# EAGLE design RefloLeo_v1.3 (EAGLE 6.3)
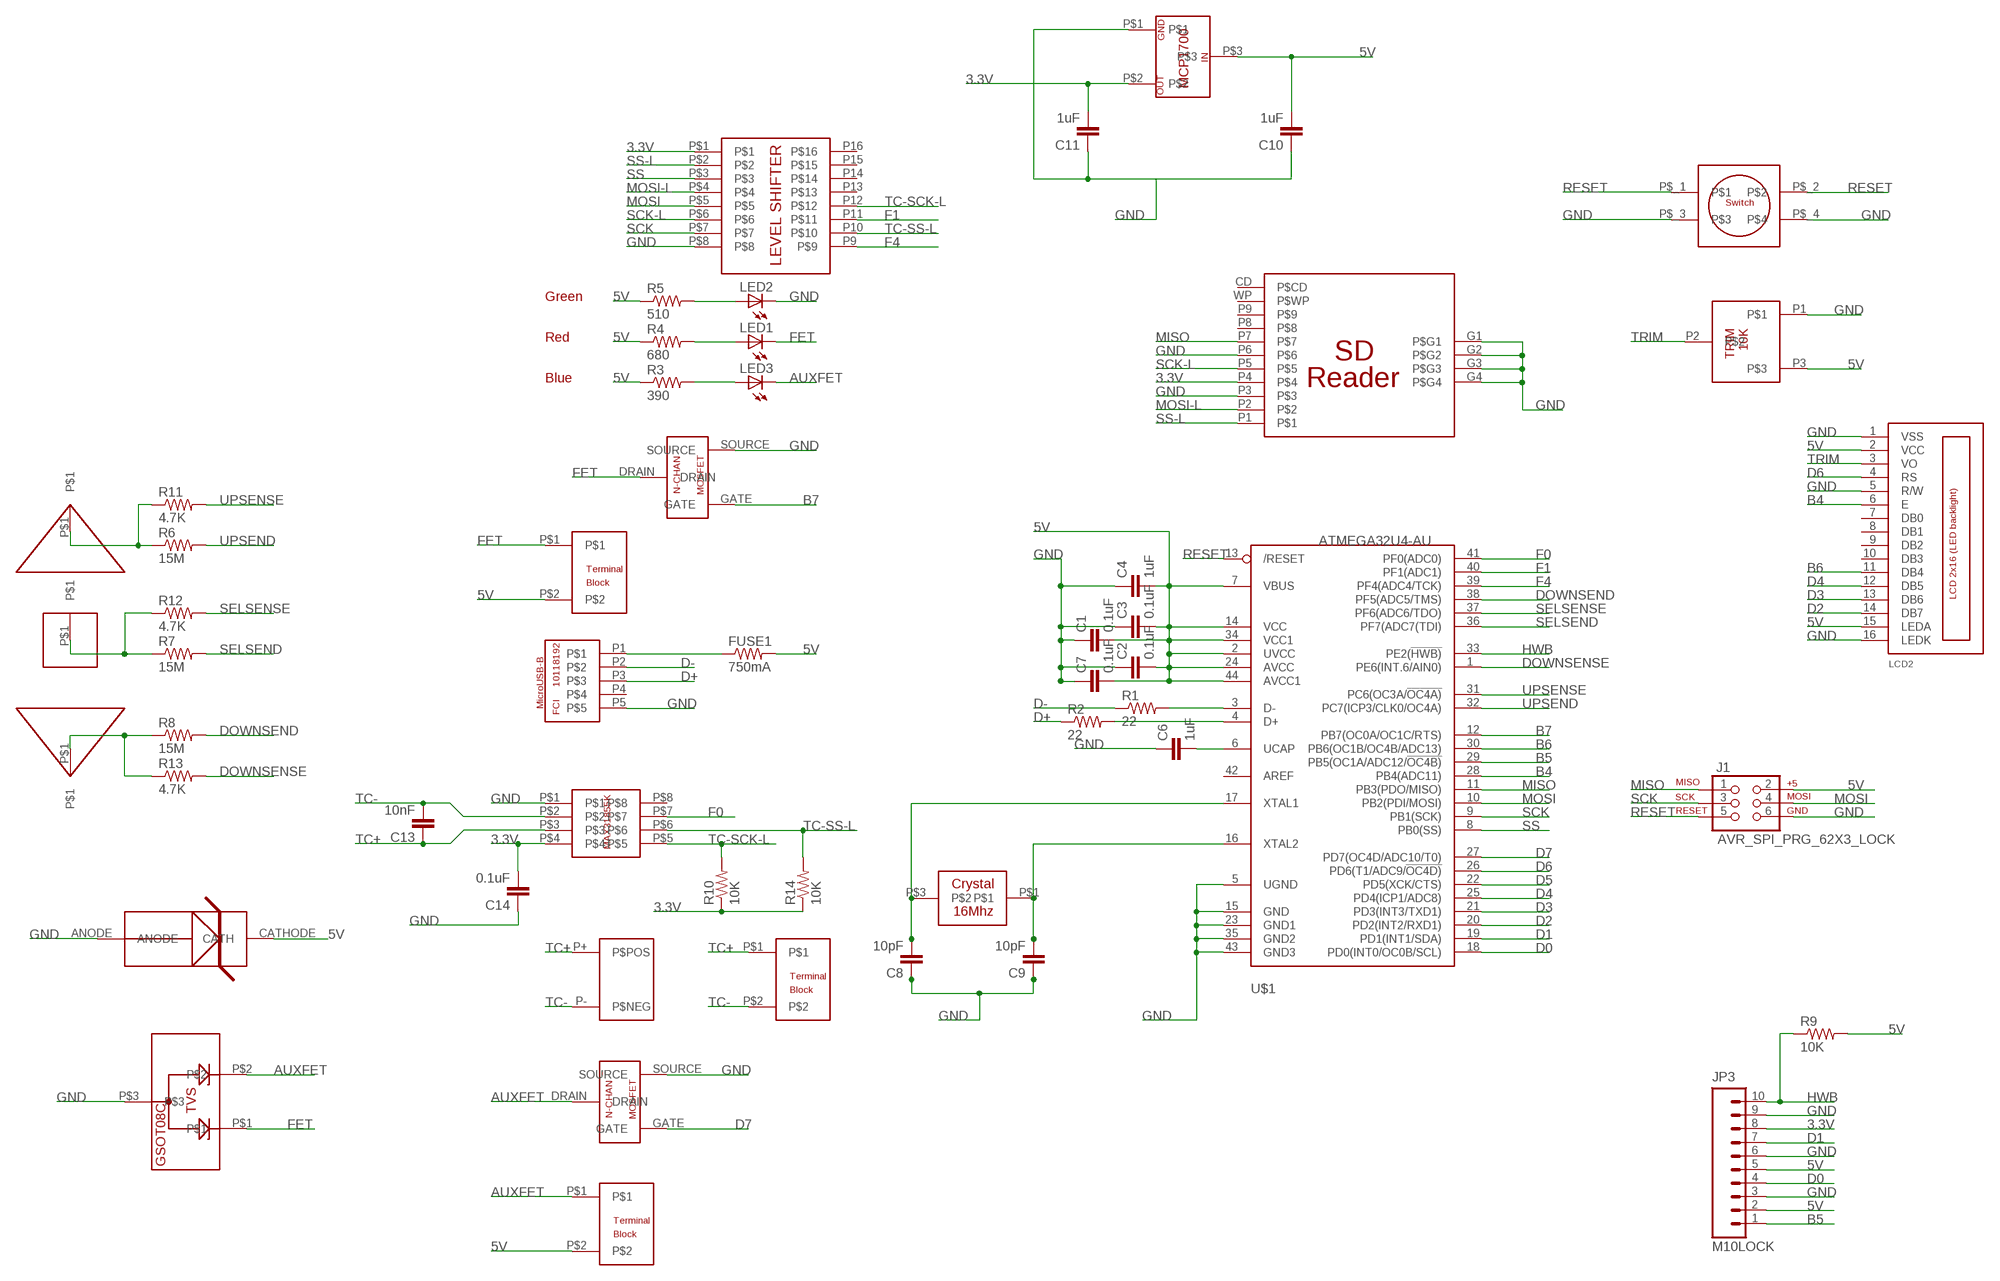
[diagram p0: schematic, sheet 1]

## Parts
C1  0.1uF  CAP0603-CAP  [0603-CAP]
C2  0.1uF  CAP0603-CAP  [0603-CAP]
C3  0.1uF  CAP0603-CAP  [0603-CAP]
C4  1uF  CAP0603-CAP  [0603-CAP]
C6  1uF  CAP0603-CAP  [0603-CAP]
C7  0.1uF  CAP0603-CAP  [0603-CAP]
C8  10pF  CAP0603-CAP  [0603-CAP]
C9  10pF  CAP0603-CAP  [0603-CAP]
C10  1uF  CAP0603-CAP  [0603-CAP]
C11  1uF  CAP0603-CAP  [0603-CAP]
C13  10nF  CAP0603-CAP  [0603-CAP]
C14  0.1uF  CAP0603-CAP  [0603-CAP]
FUSE1  750mA  RESISTOR0603-RES  [0603-RES]
J1  AVR_SPI_PRG_62X3_LOCK  [2X3_LOCK]
JP3  M10LOCK  [1X10_LOCK]
LCD2  LCD_2X16_SIL  [HY-1602F]
LED1  LED0603  [LED-0603]
LED2  LED0603  [LED-0603]
LED3  LED0603  [LED-0603]
R1  22  RESISTOR0603-RES  [0603-RES]
R2  22  RESISTOR0603-RES  [0603-RES]
R3  390  RESISTOR0603-RES  [0603-RES]
R4  680  RESISTOR0603-RES  [0603-RES]
R5  510  RESISTOR0603-RES  [0603-RES]
R6  15M  RESISTOR0603-RES  [0603-RES]
R7  15M  RESISTOR0603-RES  [0603-RES]
R8  15M  RESISTOR0603-RES  [0603-RES]
R9  10K  RESISTOR0603-RES  [0603-RES]
R10  10K  RESISTOR0603-RES  [0603-RES]
R11  4.7K  RESISTOR0603-RES  [0603-RES]
R12  4.7K  RESISTOR0603-RES  [0603-RES]
R13  4.7K  RESISTOR0603-RES  [0603-RES]
R14  10K  RESISTOR0603-RES  [0603-RES]
U$1  ATMEGA32U4-AU  [TQFP44]
U$2  16MHZ-CRYSTAL_NX3225GA-16.000M-STD-CRG-1  [16MHZ-CRYSTAL_NX3225GA-16.000M-STD-CRG-1]
U$3  USB-B_10118192-0001LF  [USB-B_10118192-0001LF]
U$4  SDREADER_2041021-4  [SDREADER_2041021-4]
U$5  2POS_TERM_ED2748-ND  [2POS_TERM_ED2748-ND]
U$6  N-MOSFET630_DMG1012T-7DICT-ND  [N-MOSFET630_DMG1012T-7DICT-ND]
U$7  2POS_TERM_ED2748-ND  [2POS_TERM_ED2748-ND]
U$8  NXP_LVL_SHIFT_74HC4050D,653  [NXP_LVL_SHIFT_74HC4050D,653]
U$9  MAX_TC_MAX31855KASA+  [MAX_TC_MAX31855KASA+]
U$10  10K_TRIM_3362F-1-103LF  [10K_TRIM_3362F-1-103LF]
U$11  MCP1700__LDO  [MCP1700__LDO]
U$12  MOM-SWITCH-EG4620CT-ND  [MOM-SWITCH-EG4620CT-ND]
U$13  CAPTOUCH_ARROW  [CAPTOUCH_ARROW]
U$14  CAPTOUCH_ARROW  [CAPTOUCH_ARROW]
U$15  CAPTOUCH_SQUARE  [CAPTOUCH_SQUARE]
U$16  N-MOSFET630_DMG1012T-7DICT-ND  [N-MOSFET630_DMG1012T-7DICT-ND]
U$17  2POS_TERM_ED2748-ND  [2POS_TERM_ED2748-ND]
U$18  TVS_DIODE_MATRIX_GSOT08C-GS08  [TVS_DIODE_MATRIX_GSOT08C-GS08]
U$19  TVS_DIODE_1CH_1SMB6.0AT3G  [TVS_DIODE_1CH_1SMB6.0AT3G]
U$20  CUSTOM_K-TYPE  [CUSTOM_K-TYPE]

## Nets
3.3V: C11.2 C14.2 JP3.8 R10.1 R14.1 U$4.P4 U$8.P$1 U$9.P$4 U$11.P$2
5V: C1.2 C2.2 C3.2 C4.2 C7.2 C10.2 FUSE1.2 J1.2 JP3.2 JP3.5 LCD2.2(VCC) LCD2.15(LEDA) R3.1 R4.1 R5.1 R9.2 U$1.2(UVCC) U$1.7(VBUS) U$1.14(VCC) U$1.24(AVCC) U$1.34(VCC1) U$1.44(AVCC1) U$5.P$2 U$10.P3 U$11.P$3 U$17.P$2 U$19.CATHODE(CATH)
AUXFET: LED3.C U$16.DRAIN U$17.P$1 U$18.P$2
B4: LCD2.6(E) U$1.28(PB4(ADC11))
B5: JP3.1 U$1.29(PB5(OC1A/ADC12/!OC4B))
B6: LCD2.11(DB4) U$1.30(PB6(OC1B/OC4B/ADC13))
B7: U$1.12(PB7(OC0A/OC1C/RTS)) U$6.GATE
D0: JP3.4 U$1.18(PD0(INT0/OC0B/SCL))
D1: JP3.7 U$1.19(PD1(INT1/SDA))
D2: LCD2.14(DB7) U$1.20(PD2(INT2/RXD1))
D3: LCD2.13(DB6) U$1.21(PD3(INT3/TXD1))
D4: LCD2.12(DB5) U$1.25(PD4(ICP1/ADC8))
D5: U$1.22(PD5(XCK/CTS))
D6: LCD2.4(RS) U$1.26(PD6(T1/ADC9/!OC4D))
D7: U$1.27(PD7(OC4D/ADC10/T0)) U$16.GATE
D+: R2.1 U$3.P3
D-: R1.1 U$3.P2
DOWNSEND: R8.2 U$1.38(PF5(ADC5/TMS))
DOWNSENSE: R13.2 U$1.1(PE6(INT.6/AIN0))
F0: U$1.41(PF0(ADC0)) U$9.P$7
F1: U$1.40(PF1(ADC1)) U$8.P11
F4: U$1.39(PF4(ADC4/TCK)) U$8.P9
FET: LED1.C U$5.P$1 U$6.DRAIN U$18.P$1
GND: C1.1 C2.1 C3.1 C4.1 C6.1 C7.1 C8.1 C9.1 C10.1 C11.1 C14.1 J1.6 JP3.3 JP3.6 JP3.9 LCD2.1(VSS) LCD2.5(R/W) LCD2.16(LEDK) LED2.C U$1.5(UGND) U$1.15(GND) U$1.23(GND1) U$1.35(GND2) U$1.43(GND3) U$3.P5 U$4.G1(P$G1) U$4.G2(P$G2) U$4.G3(P$G3) U$4.G4(P$G4) U$4.P3 U$4.P6 U$6.SOURCE U$8.P$8 U$9.P$1 U$10.P1 U$11.P$1 U$12.P$_3 U$12.P$_4 U$16.SOURCE U$18.P$3 U$19.ANODE
HWB: JP3.10 R9.1 U$1.33(PE2(!HWB))
MISO: J1.1 U$1.11(PB3(PDO/MISO)) U$4.P7
MOSI: J1.4 U$1.10(PB2(PDI/MOSI)) U$8.P$5
MOSI-L: U$4.P2 U$8.P$4
N$1: C8.2 U$1.17(XTAL1) U$2.P$3
N$2: C9.2 U$1.16(XTAL2) U$2.P$1
N$3: LED1.A R4.2
N$4: LED2.A R5.2
N$5: FUSE1.1 U$3.P1
N$6: LED3.A R3.2
N$7: R1.2 U$1.3(D-)
N$8: C6.2 U$1.6(UCAP)
N$9: R2.2 U$1.4(D+)
N$15: R6.1 R11.1 U$13.P$1
N$16: R7.1 R12.1 U$15.P$1
N$17: R8.1 R13.1 U$14.P$1
RESET: J1.5 U$1.13(/RESET) U$12.P$_1 U$12.P$_2
SCK: J1.3 U$1.9(PB1(SCK)) U$8.P$7
SCK-L: U$4.P5 U$8.P$6
SELSEND: R7.2 U$1.36(PF7(ADC7(TDI))
SELSENSE: R12.2 U$1.37(PF6(ADC6/TDO))
SS: U$1.8(PB0(SS)) U$8.P$3
SS-L: U$4.P1 U$8.P$2
TC+: C13.1 U$7.P$1 U$9.P$3 U$20.P+(P$POS)
TC-: C13.2 U$7.P$2 U$9.P$2 U$20.P-(P$NEG)
TC-SCK-L: R10.2 U$8.P12 U$9.P$5
TC-SS-L: R14.2 U$8.P10 U$9.P$6
TRIM: LCD2.3(VO) U$10.P2
UPSEND: R6.2 U$1.32(PC7(ICP3/CLK0/OC4A))
UPSENSE: R11.2 U$1.31(PC6(OC3A/!OC4A))
Unconnected: LCD2.7(DB0) LCD2.8(DB1) LCD2.9(DB2) LCD2.10(DB3) U$1.42(AREF) U$3.P4 U$4.CD(P$CD) U$4.P8 U$4.P9 U$4.WP(P$WP) U$8.P13 U$8.P14 U$8.P15 U$8.P16 U$9.P$8

## Notes on the sheet
- Green
- Red
- Blue

## Library data of the parts
C1-C4 C6-C11 C13 C14 = SparkFun-Capacitors:CAP: Capacitor Standard 0603 ceramic capacitor, and 0.1" leaded capacitor.
FUSE1 R1-R14 = SparkFun-Passives:RESISTOR: Resistor Basic schematic elements and footprints for 0603, 1206, and PTH resistors.
J1 = SparkFun-Connectors:AVR_SPI_PRG_6: AVR ISP 6 Pin This is the reduced ISP connector for AVR programming. Common on Arduino. This footprint will take up less PCB space and can be used with a 10-pin to 6-pin adapter such as SKU: BOB-08508
JP3 = SparkFun-Connectors:M10: Header 10 Standard 10-pin 0.1" header. Use with straight break away headers (SKU : PRT-00116), right angle break away headers (PRT-00553), swiss pins (PRT-00743), machine pins (PRT-00117), and female headers (PRT-00115).
LCD2 = lcd_2x16_led_backlight:LCD_2X16_SIL
LED1-LED3 = SparkFun-LED:LED: LEDs Standard schematic elements and footprints for 5mm, 3mm, 1206, and 0603 sized LEDs. 5mm - Spark Fun Electronics SKU : COM-00529 (and others)
U$1 = adafruit:ATMEGA32U4: http://www.ladyada.net/library/eagle
U$2 = JKCustom:16MHZ-CRYSTAL_NX3225GA-16.000M-STD-CRG-1
U$3 = JKCustom:USB-B_10118192-0001LF
U$4 = JKCustom:SDREADER_2041021-4
U$5 U$7 U$17 = JKCustom:2POS_TERM_ED2748-ND
U$6 U$16 = JKCustom:N-MOSFET630_DMG1012T-7DICT-ND
U$8 = JKCustom:NXP_LVL_SHIFT_74HC4050D,653
U$9 = JKCustom:MAX_TC_MAX31855KASA+
U$10 = JKCustom:10K_TRIM_3362F-1-103LF
U$11 = JKCustom:MCP1700__LDO
U$12 = JKCustom:MOM-SWITCH-EG4620CT-ND
U$13 U$14 = JKCustom:CAPTOUCH_ARROW
U$15 = JKCustom:CAPTOUCH_SQUARE
U$18 = JKCustom:TVS_DIODE_MATRIX_GSOT08C-GS08
U$19 = JKCustom:TVS_DIODE_1CH_1SMB6.0AT3G
U$20 = RefloLeo_Lib:CUSTOM_K-TYPE

## Board
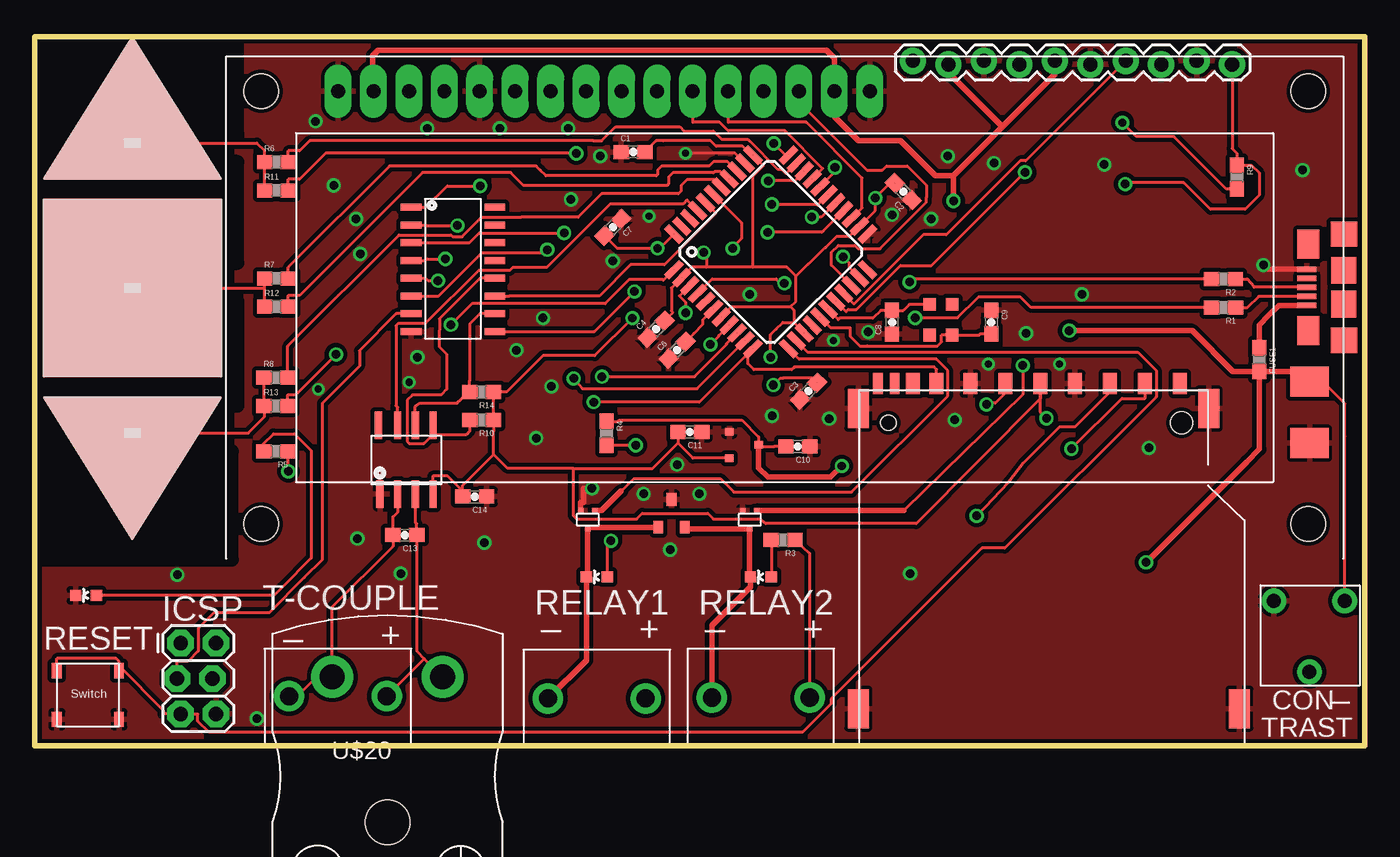
[diagram p1: board, top side]
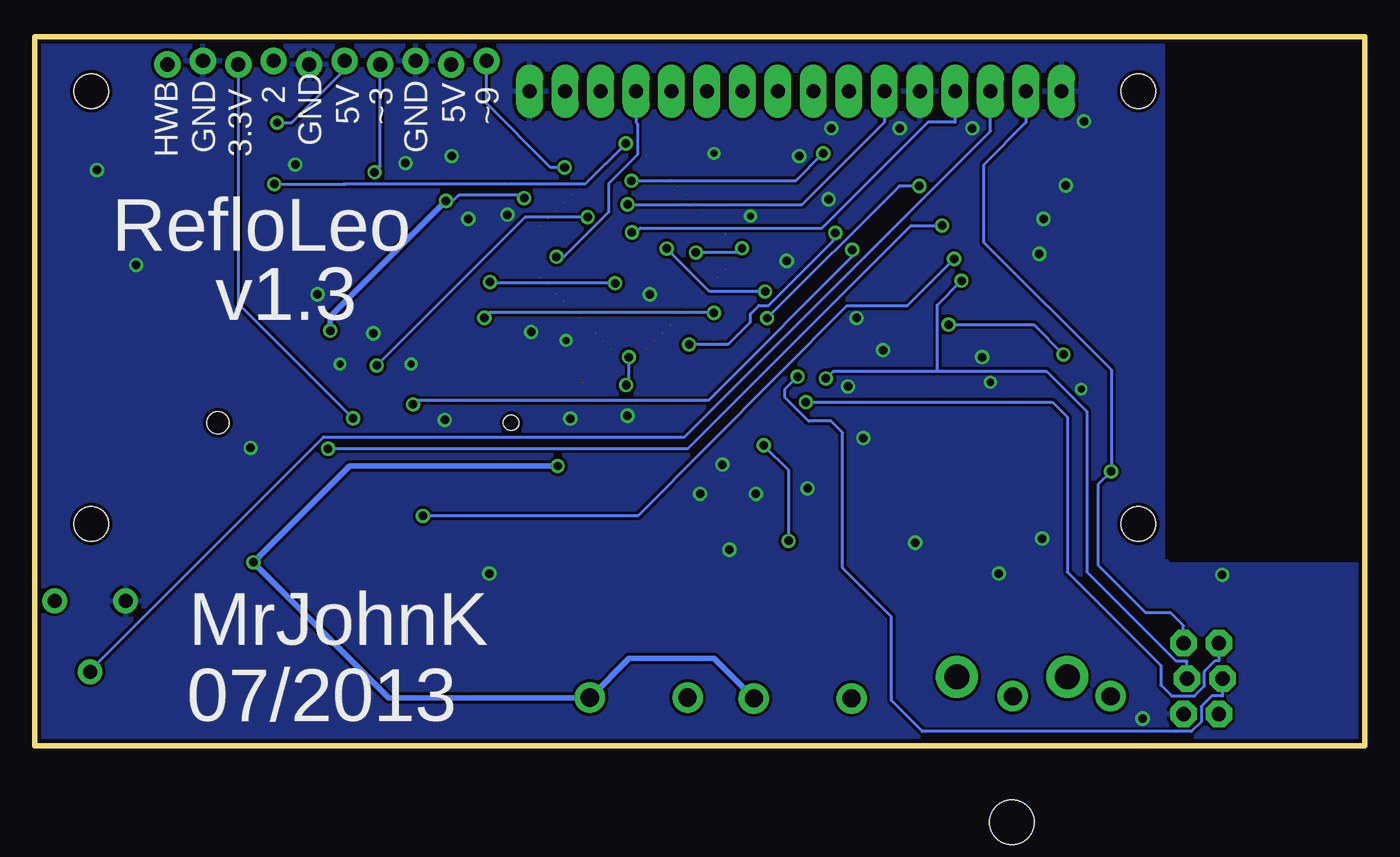
[diagram p2: board, bottom side, seen from below]

Size 95.25 x 50.8 mm. Coordinates in mm from the lower left corner, seen from the top.
Outline: 95.25,0 95.25,50.8 0,50.8 0,0 95.25,0
Copper layers (1*16): Top 0.035mm / dielectric 1.5mm / Bottom 0.035mm
Design rules "default *": minimum track width 8mil, minimum drill 24mil, track to track 8mil, track to pad 8mil, pad to pad 8mil, via to via 8mil, smd to smd 8mil, copper to edge 10mil, drill to drill 8mil, minimum pad ring 8mil, minimum via ring 8mil, stop-mask expansion 12mil, vias tented up to drill 0mil, thermal gap 10mil
tRestrict: area 0,13.3 to 14.1,21.1; area 0,24.3 to 14.5,31.8; area 0.2,34.6 to 14.5,41.8; area 0,43.8 to 14.5,50.6
bRestrict: area 0.2,13.3 to 13.9,50.6

### Footprints (pad centres in the part's own frame; a part is rotated, then mirrored left to right if it is on the bottom)
0603-CAP = smd 1.1 x 1: 1 -0.85,0; 2 0.85,0
0603-RES = smd 1.1 x 1: 1 -0.85,0; 2 0.85,0
2X3_LOCK = drill 1.016 pad 1.88 octagon: 1 0,0; 2 0,2.54; 3 2.54,-0.254; 4 2.54,2.286; 5 5.08,0; 6 5.08,2.54
1X10_LOCK = drill 1.016 pad 1.88: 1 0,0.127; 2 2.54,-0.127; 3 5.08,0.127; 4 7.62,-0.127; 5 10.16,0.127; 6 12.7,-0.127; 7 15.24,0.127; 8 17.78,-0.127; 9 20.32,0.127; 10 22.86,-0.127
HY-1602F = drill 1 pad 1.93 long: 1 2.54,0; 2 5.08,0; 3 7.62,0; 4 10.16,0; 5 12.7,0; 6 15.24,0; 7 17.78,0; 8 20.32,0; 9 22.86,0; 10 25.4,0; 11 27.94,0; 12 30.48,0; 13 33.02,0; 14 35.56,0; 15 38.1,0; 16 40.64,0 | hole 2.5: -2.96,0; 72.04,0; -2.96,-31; 72.04,-31
LED-0603 = smd 0.8 x 0.8: A 0,-0.75; C 0,0.75
TQFP44 = smd 1.5 x 0.5: 1 -5.8,4; 2 -5.8,3.2; 3 -5.8,2.4; 4 -5.8,1.6; 5 -5.8,0.8; 6 -5.8,0; 7 -5.8,-0.8; 8 -5.8,-1.6; 9 -5.8,-2.4; 10 -5.8,-3.2; 11 -5.8,-4; 23 5.8,-4; 24 5.8,-3.2; 25 5.8,-2.4; 26 5.8,-1.6; 27 5.8,-0.8; 28 5.8,0; 29 5.8,0.8; 30 5.8,1.6; 31 5.8,2.4; 32 5.8,3.2; 33 5.8,4 | smd 0.5 x 1.5: 12 -4,-5.8; 13 -3.2,-5.8; 14 -2.4,-5.8; 15 -1.6,-5.8; 16 -0.8,-5.8; 17 0,-5.8; 18 0.8,-5.8; 19 1.6,-5.8; 20 2.4,-5.8; 21 3.2,-5.8; 22 4,-5.8; 34 4,5.8; 35 3.2,5.8; 36 2.4,5.8; 37 1.6,5.8; 38 0.8,5.8; 39 0,5.8; 40 -0.8,5.8; 41 -1.6,5.8; 42 -2.4,5.8; 43 -3.2,5.8; 44 -4,5.8
16MHZ-CRYSTAL_NX3225GA-16.000M-STD-CRG-1 = smd 0.9 x 0.9: P$1 -1.1,-0.8; P$3 1.1,0.8; P$NC_2 1.1,-0.8; P$NC_4 -1.1,0.8
USB-B_10118192-0001LF = smd 0.4 x 1.35: P1 -1.3,2.65; P2 -0.65,2.65; P3 0,2.65; P4 0.65,2.65; P5 1.3,2.65 | smd 1.8 x 1.9: P$1_NC -3.8,0; P$2_NC 3.8,0 | smd 1.9 x 1.8: P$3_NC -1.2,0; P$4_NC 1.2,0 | smd 2.1 x 1.6: P$5_NC -3.1,2.55; P$6_NC 3.1,2.55
SDREADER_2041021-4 = smd 0.7 x 1.5: CD -11.05,24.7; WP -12.25,24.7 | smd 1.5 x 2.8: G1 11.45,22.9; G2 13.65,1.4; G3 -13.65,1.4; G4 -13.65,22.9 | smd 1 x 1.5: P1 6.875,24.7; P2 4.375,24.7; P3 1.875,24.7; P4 -0.625,24.7; P5 -3.125,24.7; P6 -5.625,24.7; P7 -8.05,24.7; P8 -9.75,24.7; P9 9.375,24.7 | hole 1.1: -11.5,21.9 | hole 1.6: 9.5,21.9
2POS_TERM_ED2748-ND = drill 1.3 pad 2.184: P$1 0,0; P$2 7,0
N-MOSFET630_DMG1012T-7DICT-ND = smd 0.4 x 0.4: DRAIN 0,1.3; GATE -0.5,0; SOURCE 0.5,0
NXP_LVL_SHIFT_74HC4050D,653 = smd 0.5 x 1.5: P9 8.89,6; P10 7.62,6; P11 6.35,6; P12 5.08,6; P13 3.81,6; P14 2.54,6; P15 1.27,6; P16 0,6; P$1 0,0; P$2 1.27,0; P$3 2.54,0; P$4 3.81,0; P$5 5.08,0; P$6 6.35,0; P$7 7.62,0; P$8 8.89,0
MAX_TC_MAX31855KASA+ = smd 1.98 x 0.53: P$1 0,0; P$2 0,-1.27; P$3 0,-2.54; P$4 0,-3.81; P$5 4.93,-3.81; P$6 4.93,-2.54; P$7 4.93,-1.27; P$8 4.93,0.1
10K_TRIM_3362F-1-103LF = drill 1 pad 1.778: P1 -2.54,5.08; P2 0,0; P3 2.54,5.08
MCP1700__LDO = smd 0.54 x 0.62: P$1 0,0; P$2 1.9,0; P$3 0.95,2.1
MOM-SWITCH-EG4620CT-ND = smd 0.7 x 1.1: P$_1 -2.225,3.95; P$_2 2.225,3.95; P$_3 -2.225,0.45; P$_4 2.225,0.45
CAPTOUCH_ARROW = smd 1.27 x 0.635: P$1 0,2.54
CAPTOUCH_SQUARE = smd 1.27 x 0.635: P$1 0,0
TVS_DIODE_MATRIX_GSOT08C-GS08 = smd 0.7 x 0.9: P$1 -0.95,0; P$2 0.95,0; P$3 0,2
TVS_DIODE_1CH_1SMB6.0AT3G = smd 2.159 x 2.743: ANODE 2.21,0; CATHODE -2.21,0
CUSTOM_K-TYPE = drill 1.8 pad 3: P+ 3.95,7.9; P- -3.95,7.9 | hole 3.2: 0,-2.5

### Placement (x,y rotation side)
C1  42.85,42.54 0 top
C2  62.21,39.7 135 top
C3  55.42,25.4 45 top
C4  44.5,29.84 45 top
C6  46,28.34 45 top
C7  41.4,37.14 225 top
C8  61.4,30.34 90 top
C9  68.51,30.35 270 top
C10  54.65,21.43 180 top
C11  46.92,22.47 180 top
C13  26.5,15.09 180 top
C14  31.5,17.84 180 top
FUSE1  87.71,27.66 270 top
J1  10.43,7.35 270 top
JP3  62.9,48.94 0 top
LCD2  19.17,46.89 0 top
LED1  40.25,12.09 90 top
LED2  3.66,10.77 90 top
LED3  52,12.09 90 top
R1  85.15,31.39 180 top
R2  85.14,33.43 180 top
R3  53.6,14.74 180 top
R4  40.95,22.38 270 top
R5  17.25,21.09 180 top
R6  17.3,41.81 0 top
R7  17.3,33.48 0 top
R8  17.26,26.37 0 top
R9  86.1,40.74 270 top
R10  32,23.34 180 top
R11  17.3,39.78 0 top
R12  17.3,31.45 0 top
R13  17.26,24.34 0 top
R14  32,25.34 180 top
U$1  52.7,35.37 45 top
U$2  64.91,30.52 90 top
U$3  93.77,32.84 90 top
U$4  72.64,1.24 0 top
U$5  36.75,3.38 0 top
U$6  39.6,16.84 180 top
U$7  25.2,3.54 180 top
U$8  26.94,38.57 270 top
U$9  24.71,18.02 90 top
U$10  91.3,5.3 0 top
U$11  49.74,22.51 270 top
U$12  3.8,1.44 0 top
U$13  6.99,40.64 0 top
U$14  6.99,24.94 180 top
U$15  6.99,32.79 0 top
U$16  51.2,16.84 180 top
U$17  48.5,3.44 0 top
U$18  45.6,15.64 0 top
U$19  91.31,23.89 270 top
U$20  25.25,-2.97 0 top

### Tracks (layer width: path | path; a pad name or v marks a point on that pad's centre or on a via)
3.3V  (via drill 0.6, 0.61 pad 1.02)
  Top 0.203: v31.9,40.1 29.53,40.1 28,38.57 U$8.P$1 | 38.57,19.86 38.57,16.52 38.57,16.47 38.8,16.24 43.1,16.24 43.5,16.64 48.2,16.64 48.6,16.24 51.92,16.24 52.35,15.91 63.13,15.91 72.01,24.89 U$4.P4 72,24.84 72,23.92 v72.46,23.46 | 38.57,19.86 33.87,19.86 32.87,20.86 | 38.57,19.86 44.26,19.86 46.06,21.67 | C11.2 46.06,21.67 | U$11.P$2 47.13,20.61 46.06,21.67 | U$9.P$4 28.52,19.32 29.57,19.32 30.65,18.24 | 30.65,18.24 30.65,18.64 32.87,20.86 | C14.2 30.65,18.24 | 32.87,20.86 32.87,22.52 32.85,22.54 R10.1 R14.1 33.8,25.34 36.4,27.94 40.1,27.94 v42.8,30.64
  Bottom 0.203: v31.9,40.1 | JP3.8 80.68,33.88 80.68,31.68 v72.46,23.46 | v31.9,40.1 33.34,40.1 v42.8,30.64
5V  (via drill 0.6, 0.61 pad 1.02)  (8 unrouted)
  Top 0.203: 51.43,34.28 48.1,34.28 | 48.1,34.28 47.08,34.28 | 47.08,34.28 | 54.5,33.64 53.86,34.28 51.43,34.28 | 51.43,34.28 51.43,40.81 52.17,41.56 51.8,41.93 U$1.34 51.34,42.3 50.7,42.94 48.8,42.94 48.4,43.34 45,43.34 44.5,43.34 C1.2 | 57.27,46.92 LCD2.15 | C2.2 61.24,40.3 60.2,39.25 v60.2,39.24 60.2,38.35 U$1.24 58.32,36.47 | 58.32,36.47 | 58.32,36.47 57.41,36.47 56.63,35.68 56.59,35.68 55.4,34.5 55.36,34.5 54.5,33.64 | 54.12,31.45 54.5,31.84 54.5,33.64 | 54.12,31.45 54.36,31.21 54.36,30.32 | 54.12,31.45 49.91,31.45 U$1.7 | C4.2 | C4.2 45.17,30.51 45.4,30.74 45.71,31.05 45.59,31.16 45.59,32.79 U$1.2 47.08,34.28 | C10.2 52.95,21.43 51.84,21.43 51.84,21.55 U$11.P$3 51.84,22.13 50.65,23.33 41.84,23.33 41.75,23.23 R4.1 | U$10.P3 93.84,22.19 93.84,24.5 92.3,26.04 91.37,26.04 U$19.CATHODE | U$1.14 54.36,30.32 | R5.1 18.1,19.71 v18.15,19.65 | 44.7,30.44 C4.2 | v52.7,27.84 52.7,29.44 53.1,29.84 53.58,30.32 54.36,30.32 | C3.2 55.68,26.34 53.6,26.34 53.4,26.34 v52.9,25.84 | R9.2 85.35,39.89 81.6,43.64 78.9,43.64 v77.9,44.64 | 45.61,36.65 U$1.44 44.77,35.64 v44.6,35.64 41.7,35.64 C7.2 | v47.9,35.34 48.1,35.14 48.1,34.28 | R3.1 55.5,13.79 U$17.P$2
  Top 0.406: v79.6,13.14 86.8,20.34 87.71,21.25 FUSE1.2 | FUSE1.2 85.83,26.82 82.9,29.74 v74.1,29.74 | v65.8,39.04 65.8,40.84 | 65.8,40.84 69.3,44.34 | JP3.2 65.44,48.2 69.3,44.34 | JP3.5 73.06,48.1 69.3,44.34 | FUSE1.2 90.6,26.82 U$19.CATHODE | 65.8,40.84 64.5,40.84 62,43.34 59,43.34 57.27,45.07 57.27,46.92 57.27,49.27 56.7,49.84 24.6,49.84 24.2,49.44 24.2,46.94 LCD2.2 | 51.84,21.55 51.84,19.9 52.5,19.24 57,19.24 v57.8,20.04
  Bottom 0.203: LCD2.2 24.25,44.66 27.3,41.61 27.3,36.08 18.15,26.94 v18.15,19.65 19.1,18.71 19.1,12.94 15.7,9.54 13.9,9.54 12.97,8.61 12.97,8.59 J1.2 | v52.9,25.84 52.7,26.04 v52.7,27.84 | v60.2,39.24 60.4,39.44 64.9,39.44 65.3,39.04 v65.8,39.04 | v77.9,44.64 76.86,44.64 73.06,48.44 JP3.5 | v44.6,35.64 44.9,35.34 v47.9,35.34
  Bottom 0.406: U$5.P$2 46.61,6.24 51.8,6.24 52.7,6.24 U$17.P$2 69.9,3.44 v79.6,13.14 72.7,20.04 v57.8,20.04 | v74.1,29.74 74.1,30.74 v65.8,39.04
AUXFET
  Top 0.203: 51.25,11.74 LED3.C
  Top 0.406: 51.25,11.74 51.25,11.39 48.5,8.64 U$17.P$1 | LED3.C 51.2,12.14 U$16.DRAIN 46.65,15.54 U$18.P$2
B4  (via drill 0.61 pad 1.02)  (1 unrouted)
  Top 0.203: U$1.28 56.06,38.73 56.01,38.78 v52.79,38.78
  Bottom 0.203: LCD2.6 34.41,44.66 40.29,38.78 v52.79,38.78
B5  (via drill 0.61 pad 1.02)  (1 unrouted)
  Top 0.203: U$1.29 57.31,41.11 v57.31,41.43
  Bottom 0.203: v57.31,41.43 58.31,41.43 62.9,46.02 JP3.1
B6  (1 unrouted)
  Top 0.203: LCD2.11 47.11,44.66 49.05,44.66 49.65,44.06 53.71,44.06 56.42,41.35 U$1.30
B7  (1 unrouted)
  Top 0.203: U$1.12 54.73,27.68 64.57,27.68 65.39,26.86 65.39,25.07 58.5,18.18 50.06,18.18 49.1,19.14 42.91,19.14 42.01,18.24 42,18.24
  Top 0.406: U$6.GATE 40.6,16.84 42,18.24
D0  (via drill 0.61 pad 1.02)  (1 unrouted)
  Top 0.203: U$1.18 58.12,31.09 58.27,31.25 58.85,31.25 62,34.41 64.23,34.41 v70.92,41.09
  Bottom 0.203: v70.92,41.09 70.52,41.49 JP3.4
D1  (1 unrouted)
  Top 0.203: JP3.7 70.98,41.9 70.58,41.9 65.29,36.61 63.64,36.61 58.68,31.66 U$1.19
D2  (1 unrouted)
  Top 0.203: U$1.20 57.05,34.42 57.05,35.35 57.55,35.85 58.73,35.85 58.97,35.61 60.54,35.61 63.86,38.94 63.86,39.27 63.86,40.18 63.7,40.34 62.5,41.54 61,41.54 60.7,41.24 59.6,41.24 54.73,46.11 LCD2.14
D3  (via drill 0.61 pad 1.02)  (1 unrouted)
  Top 0.203: U$1.21 58.32,34.28 58.32,34.61 v57.89,35.03
  Bottom 0.203: LCD2.13 52.19,44.66 52.09,44.55 52.09,42.34 54.15,40.28 54.15,38.22 57.33,35.03 v57.89,35.03
D4  (1 unrouted)
  Top 0.203: LCD2.12 49.65,44.66 55.26,44.66 59.25,40.67 59.25,38.52 U$1.25
D6  (via drill 0.61 pad 1.02)  (1 unrouted)
  Top 0.203: U$1.26 56.45,36.86 56.38,36.78 v52.48,36.78
  Bottom 0.203: LCD2.4 29.33,44.66 31.29,44.66 38.86,37.08 51.88,37.08 v52.48,36.78
D7  (via drill 0.61 pad 1.02)  (1 unrouted)
  Top 0.203: v70.77,27.24 70.77,25.16 62.25,16.84 | U$1.27 56.33,37.87 v55.66,37.87
  Top 0.406: 62.25,16.84 U$16.GATE
  Bottom 0.203: v55.66,37.87 60.14,37.87 v70.77,27.24
D+
  Top 0.203: R2.1 86.84,33.43 87.33,32.84 U$3.P3
D-
  Top 0.203: R1.1 86.85,31.39 87.65,32.19 U$3.P2
DOWNSEND  (1 unrouted)
  Top 0.203: R8.2 18.11,28.63 26.08,36.6 29.8,36.6 29.93,36.46 30.61,36.46 32.01,37.86 34.83,37.86 38.92,37.86 40.6,39.54 46.1,39.54 46.3,39.74 46.3,40.14 46.7,40.54 48.67,40.54 U$1.38 48.68,40.52
DOWNSENSE  (via drill 0.61 pad 1.02)  (1 unrouted)
  Top 0.203: U$1.1 45.03,33.36 44.98,33.4 42.57,33.4 40.84,31.67 31.3,31.67 v29.8,30.17 | R13.2 18.11,25.14 18.68,25.14 v21.57,28.04
  Bottom 0.203: v29.8,30.17 23.7,30.17 v21.57,28.04
F0  (1 unrouted)
  Top 0.203: U$1.41 46.72,39.09 46.45,38.81 41.2,38.81 36.66,34.27 34.23,34.27 34.02,34.06 31.78,34.06 27.97,30.24 26,30.24 25.87,30.1 25.87,24.36 25.98,24.25 U$9.P$7
F1  (1 unrouted)
  Top 0.203: U$1.40 48.78,38.16 45.09,34.47 45.09,34.46 42.67,34.46 40.43,32.22 34,32.22 U$8.P11
F4  (via drill 0.61 pad 1.02)  (1 unrouted)
  Top 0.203: U$8.P9 40.08,29.68 v42.95,32.55 | U$1.39 50.6,37.48 50.6,36.34 49.99,35.73 v49.99,35.62
  Bottom 0.203: v42.95,32.55 44.32,32.55 46.92,32.55 v49.99,35.62
FET
  Top 0.406: U$5.P$1 39.5,6.13 LED1.C 39.6,12.19 U$6.DRAIN 39.7,15.64 U$18.P$1
GND  (via drill 0.51 pad 0.76, 0.61 pad 1.02)
  Top 0.203: U$1.35 50.16,42.44 v46.6,42.44
  Top 0.206: C7.1 42.2,37.94
  Top 0.406: U$3.P5 88.3,34.14 v88,34.44 | U$6.SOURCE 39.1,17.44 39.3,17.44 39.3,18.44 v39.9,18.44
  other vias: 65.9,23.34 59.7,29.64 76.6,41.64 62.7,12.34 90.8,41.24 71,29.54 73.4,27.34 61.4,38.04 57.2,29.04 52.8,23.64 35.9,22.04 45.5,14.04 51.2,32.34 37,25.74 34.5,28.34 27.4,27.84 26.8,26.04 20.3,25.54 32.2,14.54 26.2,12.34 56.9,23.44 40.5,42.24 10.2,12.24 38.2,44.24 20.1,44.74 33.3,44.24 44,37.94 65.4,42.24 64.2,37.74 79.8,21.34 68.3,27.34 23.1,14.84 15.9,1.94 21.4,40.14 38.4,39.14 41.4,34.74 23,37.74 23.3,35.24 36.4,30.64 28.1,44.24 68.7,41.74 75,32.34 46,20.14 47.6,18.04 43.6,18.04
  pour Top (isolate 0.3): 0,0 95.25,0 95.25,50.8 14.48,50.8 14.48,13.17 0,13.17
  pour Bottom: 0,0 95.25,0 95.25,50.8 14.48,50.8 14.48,13.17 0,13.17
HWB  (via drill 0.6, 0.61 pad 1.02)  (1 unrouted)
  Top 0.203: U$1.33 53.77,42.3 v52.92,43.15 | JP3.10 85.76,42.78 86.1,42.44 R9.1 87.15,41.59 87.7,41.04 87.7,39.44 86.7,38.44 84.2,38.44 82.3,40.34 78.2,40.34 v78.1,40.24
  Bottom 0.203: v52.92,43.15 55.83,40.24 73,40.24 | 73,40.24 73.14,40.24 | v78.1,40.24 73,40.24
MISO  (via drill 0.61 pad 1.02)  (1 unrouted)
  Top 0.203: U$1.11 51.06,28.08 | 51.06,28.08 50.83,27.84 50.68,27.7 47.6,24.62 v40.03,24.62 | U$4.P7 64.58,26.96 64.4,27.14 54.4,27.14 54.2,26.94 51.5,26.94 51.06,27.38 51.06,28.08
  Bottom 0.203: J1.1 10.43,6.11 10.69,6.11 11.47,5.32 11.47,4.29 12.2,3.56 13.81,3.56 14.6,4.35 14.6,5.74 21.3,12.44 21.3,23.54 22.38,24.62 34.87,24.62 v40.03,24.62
MOSI  (via drill 0.61 pad 1.02)  (1 unrouted)
  Top 0.203: v38.59,26.31 39.23,25.58 47.43,25.58 U$1.10 | U$8.P$5 28,33.49 28.18,33.32 v28.87,33.32
  Bottom 0.203: 30.61,26.84 30.61,31.58 v28.87,33.32 | J1.4 12.72,6.05 13.5,6.05 19.9,12.46 19.9,23.94 22.8,26.84 30.61,26.84 | v38.59,26.31 38.06,26.84 30.61,26.84
MOSI-L  (via drill 0.61 pad 1.02)
  Top 0.203: U$8.P$4 28,34.76 28.11,34.88 v29.41,34.88 | U$4.P2 77.01,25.35 74.5,22.84 73.4,22.84 70.8,20.24 69.73,18.87 v67.46,16.47
  Bottom 0.203: v29.41,34.88 32.78,31.5 37.12,31.5 52.05,16.47 v67.46,16.47
N$1  (1 unrouted)
  Top 0.203: U$2.P$3 62.63,31.62 62.2,31.19 C8.2 60.59,31.19 60.03,30.62 57.65,30.62 57.55,30.53 U$1.17
N$2  (1 unrouted)
  Top 0.203: C9.2 67.7,29.5 67.63,29.42 U$2.P$1 64.95,29.42 64.95,28.93 64.66,28.64 59.61,28.64 59.6,28.64 59.1,28.64 58.4,29.34 58.4,29.94 57,29.94 U$1.16
N$3  (via drill 0.61 pad 1.02)
  Top 0.203: v41.27,14.67 41,14.41 LED1.A | R4.2 43.03,21.53 v43.04,21.52
  Bottom 0.203: v43.04,21.52 41.27,19.75 v41.27,14.67
N$4
  Top 0.203: LED2.A 13.44,10.77 17.13,10.77 17.7,11.34 19.8,13.44 19.8,21.14 18.6,22.34 17.1,22.34 16.4,21.64 R5.2
N$5
  Top 0.406: FUSE1.1 87.71,30.15 88.4,30.84 89.1,31.54 U$3.P1
N$6
  Top 0.203: R3.2 LED3.A
N$7  (via drill 0.61 pad 1.02)  (1 unrouted)
  Top 0.203: U$1.3 46.16,32.22 46.62,31.77 v46.62,31.01 | v63.05,30.66 66.09,30.66 67.54,32.1 67.58,32.14 70.6,32.14 71.35,31.39 R1.2
  Bottom 0.203: v46.62,31.01 62.7,31.01 v63.05,30.66
N$8  (2 unrouted)
  Top 0.203: U$1.6 47.85,30.53 | 47.85,30.53 47.85,30.19 47.21,29.55 C6.2 | 47.85,30.53
N$9  (via drill 0.61 pad 1.02)  (1 unrouted)
  Top 0.203: 62.76,33.33 v62.65,33.22 62.86,33.43 R2.2 | U$1.4 48.51,33.44 53.1,33.44 53.4,33.14 v53.69,33.14
  Bottom 0.203: v53.69,33.14 62.57,33.14 v62.65,33.22
N$15
  Top 0.203: U$13.P$1 15.89,43.18 16.45,42.62 R6.1 R11.1
N$16
  Top 0.203: 16.45,32.79 R7.1 | R12.1 16.45,32.79 | 16.45,32.79 7.92,32.79 U$15.P$1
N$17
  Top 0.203: U$14.P$1 15.28,22.4 16.41,23.53 R13.1 R8.1
RESET  (1 unrouted)
  Top 0.203: U$1.13 55.36,28.19 79.01,28.19 80.31,26.89 80.31,25 69.47,14.15 67.85,14.15 57.04,3.34 57.04,3 55,0.96 12.47,0.96 11.68,1.75 11.68,2.27 J1.5 9.19,2.27 9.19,2.54 6.02,5.71 | 6.02,5.71 6.02,6.03 5.81,6.24 1.57,6.24 U$12.P$_1 | U$12.P$_2 6.02,5.71
SCK  (via drill 0.61 pad 1.02)  (1 unrouted)
  Top 0.203: U$1.9 49.55,28.83 49.55,28.74 47.25,26.44 v40.62,26.44 | J1.3 10.18,6.05 10.97,6.05 11.7,6.79 11.7,8.39 12.85,9.54 16.8,9.54 19.3,12.04 20.6,13.34 20.6,24.54 23.25,27.18 23.25,28.31 25.89,30.95 U$8.P$7
  Bottom 0.203: J1.3 10.18,3.56 10.96,3.56 11.7,2.82 11.7,1.71 12.4,1.02 13.49,1.02 31.68,1.02 33.9,3.24 33.9,9.24 37.4,12.74 37.4,22.42 38.23,23.25 39.82,23.25 41.52,24.95 41.52,25.54 v40.62,26.44
SCK-L  (via drill 0.61 pad 1.02)
  Top 0.203: U$8.P$6 28.93,32.22 32.03,35.32 36.48,35.32 v36.71,35.54 | U$4.P5 69.51,25.25 68.8,24.54 68.26,24.54 v68.17,24.45
  Bottom 0.203: v68.17,24.45 67.86,24.75 47.5,24.75 46.99,24.75 46.5,25.24 36.71,35.03 v36.71,35.54
SELSEND
  Top 0.203: R7.2 18.15,34.29 25.4,41.53 35.91,41.53 36.2,41.24 36.6,40.84 44.5,40.84 44.6,40.94 44.6,41.24 44.9,41.54 48.3,41.54 48.6,41.84 49.63,41.84 U$1.36
SELSENSE  (1 unrouted)
  Top 0.203: R12.2 18.15,32.25 18.96,32.25 27.76,41.06 34.08,41.06 35,40.14 45.3,40.14 45.4,40.24 45.4,40.74 45.7,41.04 48.6,41.04 48.7,41.14 49.1,41.14 49.2,41.04 49.3,41.04 U$1.37
SS  (via drill 0.61 pad 1.02)  (1 unrouted)
  Top 0.203: v37.91,36.74 31.83,36.74 31.13,36.03 28,36.03 U$8.P$3 | U$1.8 48.99,29.39 | v48.39,28.74 48.99,29.34 48.99,29.39 | 48.99,29.39
  Bottom 0.203: v48.39,28.74 45.6,28.74 44,30.34 44,30.94 43.4,31.54 42.7,31.54 38.11,36.13 v37.91,36.74
SS-L  (via drill 0.61 pad 1.02)
  Top 0.203: U$8.P$2 28,37.3 28.03,37.27 v30.27,37.27 | U$4.P1 79.51,24.89 77.87,24.89 v74.25,21.28
  Bottom 0.203: v74.25,21.28 48.48,21.28 32.48,37.27 v30.27,37.27
TC+
  Top 0.203: 27.89,6.23 U$7.P$1 | 27.89,6.23 27.89,6.24 27.35,6.78 27.35,14.29 C13.1 27.35,15.89 27.25,15.99 U$9.P$3 | U$20.P+ 27.89,6.23
TC-
  Top 0.203: U$9.P$2 25.98,16.73 25.65,16.4 C13.2 25.65,14.29 21.3,9.94 U$20.P- 20.19,4.93 19.1,3.84 18.5,3.84 U$7.P$2
TC-SCK-L
  Top 0.203: 26.67,24.75 26.67,21.81 26.82,21.66 27.88,21.66 28.52,22.31 | 28.52,22.31 30.92,22.31 31.15,22.54 R10.2 | U$8.P12 31.89,33.49 28.99,30.59 28.99,29.77 28.99,28.57 | U$9.P$5 28.52,22.31
  Top 0.206: 28.99,28.57 29.5,28.06 29.5,25.54 29.1,25.14 27.4,25.14 27.06,25.14 26.67,24.75
TC-SS-L
  Top 0.203: R14.2 31.15,26.14 31.15,30.21 31.89,30.95 U$8.P10
  Top 0.206: U$9.P$6 27.25,24.29 27.6,24.54 30.25,24.54 R14.2
TRIM
  Bottom 0.203: U$10.P2 91.3,5.4 74.58,22.12 48.71,22.12 26.79,44.04 LCD2.3
UPSEND  (1 unrouted)
  Top 0.203: R6.2 18.15,42.62 18.96,42.62 19.68,43.34 40,43.34 40.6,43.34 41.6,44.34 46.2,44.34 46.5,44.04 48.6,44.04 49.2,43.44 51.08,43.44 51.18,43.34 | U$1.32 53.8,40.99 53.51,41.27 53.24,41.27 51.18,43.34 | 51.18,43.34 51.17,43.34
UPSENSE  (via drill 0.61 pad 1.02)  (1 unrouted)
  Top 0.203: U$1.31 54.36,40.43 54.31,40.47 v52.52,40.47 | R11.2 18.15,40.58 18.96,40.58 20.81,42.44 v38.78,42.44
  Bottom 0.203: v52.52,40.47 40.74,40.47 v38.78,42.44

### Text on the board
_tsilk: T-COUPLE | RELAY1 | RELAY2 | ICSP | _ | _ | _ | + | + | RESET | + | _ | CON | TRAST
_bsilk: GND | GND | HWB | 2 | ~9 | 5V | ~3 | 5V | GND | 3.3V | RefloLeo | v1.3 | MrJohnK | 07/2013